# EAGLE schematic MEMS-preamp (EAGLE 7.6.0)
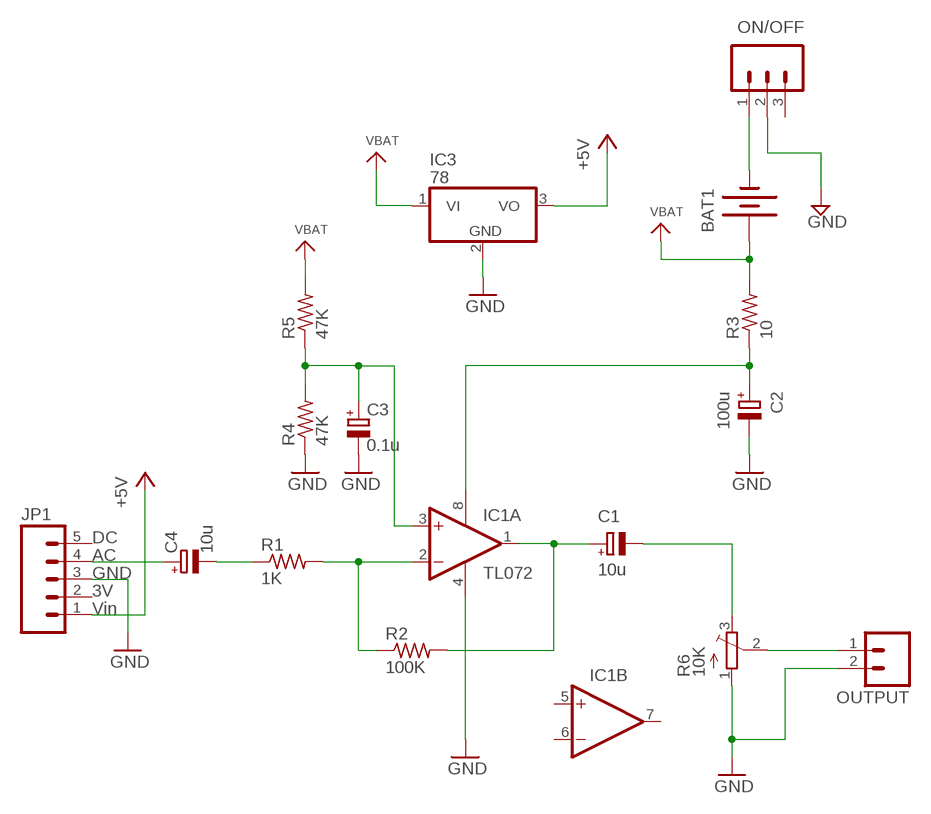
[diagram p0: schematic, sheet 1]

## Parts
BAT1  BATTERYA23  [BATTERY-A23]
C1  10u  CPOL-EUE2.5-5  [E2,5-5]
C2  100u  CPOL-EUE2.5-5  [E2,5-5]
C3  0.1u  CPOL-EUE2.5-5  [E2,5-5]
C4  10u  CPOL-EUE2.5-5  [E2,5-5]
IC1  OPA2134PA  [DIL08]
IC3  78  [TO92-]
JP1  M05LOCK  [1X05_LOCK]
ON/OFF  labl  M03SINGLE-POLE-DOUBLE-THROW  [SPDT-SWITCH]
OUTPUT  M02LOCK  [1X02_LOCK]
R1  1K  R-US_0204/5  [0204/5]
R2  100K  R-US_0204/5  [0204/5]
R3  10  R-US_0204/5  [0204/5]
R4  47K  R-US_0204/5  [0204/5]
R5  47K  R-US_0204/5  [0204/5]
R6  10K  TRIMPOT3386  [TRIM-3386]

## Nets
+5V: IC3.3(VO) JP1.1
GND: C2.- C3.- IC1.4(A:V-) IC3.2(GND) JP1.3 ON/OFF.2 OUTPUT.2 R4.1 R6.1(A)
N$1: C2.+ IC1.8(A:V+) R3.1
N$2: BAT1.GND@1(-) ON/OFF.1
N$3: C4.+ JP1.4
N$4: C4.- R1.1
N$5: IC1.2(A:-IN) R1.2 R2.1
N$6: C1.- R6.3(E)
N$7: OUTPUT.1 R6.2(S)
N$8: C3.+ IC1.3(A:+IN) R4.2 R5.1
N$9: C1.+ IC1.1(A:OUT) R2.2
VBAT: BAT1.PWR@1(+) IC3.1(VI) R3.2 R5.2
Unconnected: IC1.5(B:+IN) IC1.6(B:-IN) IC1.7(B:OUT) JP1.2 JP1.5 ON/OFF.3

## Library data of the parts
BAT1 = Daniel:BATTERY: Battery Holders Various common sizes : AA, AAA, 18650 (PRT-12895), 20mm coin cell and 12mm coin cell. 20MM_4LEGS, BATT-10373
C1-C4 = rcl:CPOL-EU: POLARIZED CAPACITOR, European symbol
IC1 = linear:OPA2*: Dual Operational Amplifier Low Power, Single-Supply, Rail-To-Rail Operational Amplifier Source: http://focus.ti.com/lit/ds/symlink/opa2345.pdf http://focus.ti.com .. opa241.pdf http://focus.ti.com/lit/ds/symlink/opa2134.pdf; IC_NAME: TL072
IC3 = CMU-ArtFab:78*: Positive VOLTAGE REGULATOR Added bigger pads to the TO-92 package
JP1 = SparkFun-Connectors:M05: Header 5 Standard 5-pin 0.1" header. Use with straight break away headers (SKU : PRT-00116), right angle break away headers (PRT-00553), swiss pins (PRT-00743), machine pins (PRT-00117), and female headers (PRT-00115). Molex polarized connector foot print use with SKU : PRT-08230 with associated crimp pins and housings.; CON1: Vin; CON2: 3V; CON3: GND; CON4: AC; CON5: DC
ON/OFF = Daniel:M03: Single Pole Double Throw Switch 2.0mm pitch 3-pin header for switch.
OUTPUT = SparkFun-Connectors:M02: Header 2 Standard 2-pin 0.1" header. Use with straight break away headers (SKU : PRT-00116), right angle break away headers (PRT-00553), swiss pins (PRT-00743), machine pins (PRT-00117), and female headers (PRT-00115). Molex polarized connector foot print use with SKU : PRT-08233 with associated crimp pins and housings.
R1-R5 = CMU-ArtFab:R-US_: RESISTOR, American symbol
R6 = adafruit:TRIMPOT: SMT trimmer potentiometer part number TC33X http://www.ladyada.net/library/eagle